# Altium schematic sheet FabricationSumo.SchDoc
size A4; SheetNumber: 1; SheetTotal: 1
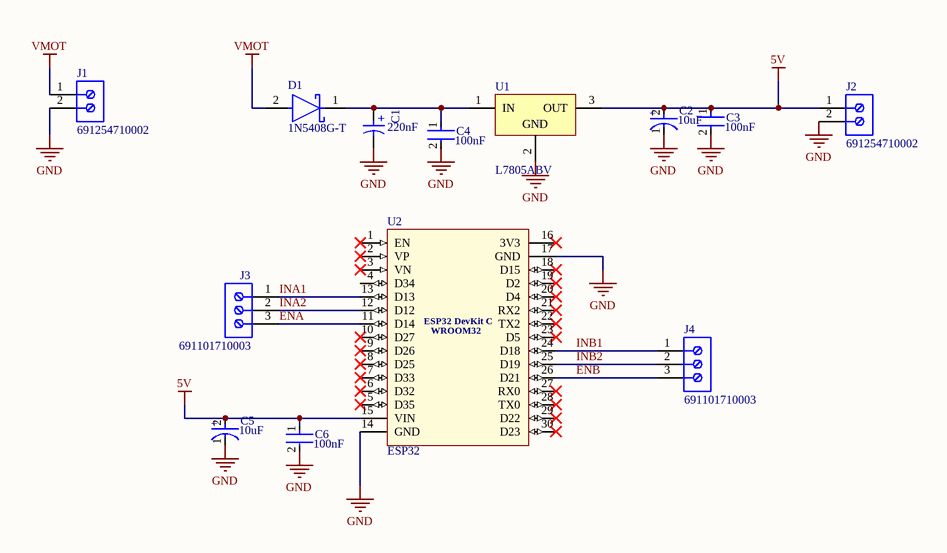
[diagram p0: FabricationSumo.SchDoc]

## Parts
C1  Capacitance: 220nF  [WCAP-ATG5_D5H11]  (hidden comment: 860020672002)
C2  Capacitance: 10uF  [FP-RAD-TH-D_4_0_5-L_7_1-F-MFG]  (hidden comment: EEAGA1E100E)
C3  Capacitance: 100nF  [FP-RDE3M1-MFG]  (hidden comment: RDED72W104K3K1H03B)
C4  Capacitance: 100nF  [FP-RDE3M1-MFG]  (hidden comment: RDED72W104K3K1H03B)
C5  Capacitance: 10uF  [FP-RAD-TH-D_4_0_5-L_7_1-F-MFG]  (hidden comment: EEAGA1E100E)
C6  Capacitance: 100nF  [FP-RDE3M1-MFG]  (hidden comment: RDED72W104K3K1H03B)
D1  1N5408G-T  [FP-DO-201AD-MFG]
J1  691254710002  [691254710002]
J2  691254710002  [691254710002]
J3  691101710003  [691101710003]
J4  691101710003  [691101710003]
U1  L7805ABV  [TO220]
U2  ESP32  [ESP32_DevKitCWROOM32]

## Nets
5V: C2.2(A) C3.1 C5.2(A) C6.1 J2.1 U1.3(OUT) U2.15(VIN)
GND: C1.2(N) C2.1(C) C3.2 C4.2 C5.1(C) C6.2 J1.2 J2.2 U1.2(GND) U2.14(GND) U2.17(GND)
VMOT: D1.2(A) J1.1
ENA: J3.3 U2.11(D14)
ENB: J4.3 U2.26(D21)
INA1: J3.1 U2.13(D13)
INA2: J3.2 U2.12(D12)
INB1: J4.1 U2.24(D18)
INB2: J4.2 U2.25(D19)
NetC1_1: C1.1(P) C4.1 D1.1(C) U1.1(IN)

Not connected (* = marked no-connect by the designer): U2 1(EN)* 2(VP)* 3(VN)* 4(D34) 5(D35)* 6(D32)* 7(D33)* 8(D25)* 9(D26)* 10(D27)* 16(3V3)* 18(D15)* 19(D2)* 20(D4)* 21(RX2)* 22(TX2)* 23(D5)* 27(RX0)* 28(TX0)* 29(D22)* 30(D23)*

## Notes on the sheet
- Documento:
- Autor:
- Carnet:
- Proyecto:
- Curso:
- Fecha:
- Revisión:
- Tamaño:
- Carta
- Hoja:
- de:
- (in symbol CMP-03913-53914225-2) +
- (in symbol CMP-05427-000151-1) +
- (in symbol ESP32-WROOM32) ESP32 DevKit C; WROOM32

## Library data of the parts
C1 = CMP-03913-53914225-2: WCAP-ATG5 Aluminum Electrolytic Capacitors; Voltage Rating (DC): 50V; Life (Hours): 2000hours; Tolerance: 20%; Leakage Current: 3µA; Pitch: 2mm; Polarity: Polar; Ripple Current: 2.9mA; Lead Pitch: 2.0066mm; Diameter: 5mm; RoHS: Compliant; REACH SVHC: Unknown; Mount: Through Hole; Voltage Rating: 50V; Max Operating Temperature: 105°C; Packaging: Tape & Box (TB); Case/Package: Radial; Height - Seated (Max): 12.4968mm; Min Operating Temperature: -40°C; Height: 11mm; Length: 11mm
C2 C5 = CMP-05427-000151-1: Aluminum Electrolytic Capacitors (Radial Lead Type) 10uF ±20% 25V
C3 C4 C6 = CMP-06035-016817-1: Ceramic Capacitor 100nF ±10% 450V X7T Radial; Tolerance: 10%; Voltage Rating: 450V; Lead Pitch: 5mm; Max Operating Temperature: 125°C; Voltage Rating (DC): 450V; Case/Package: Radial; Dielectric: X7T; Min Operating Temperature: -55°C; REACH SVHC: No SVHC
D1 = CMP-12790-000042-1: DIODE SCHOTTKY 40V 1A DO41; Manufacturer: Diodes Inc.; Manufacturer Part Number: 1N5819-T; Description: Diode Schottky 40V 1A Through Hole DO-41; Max Surge Forward Current: 25A; Capacitance: 110 pF; Max Junction Temp: +125°C; Peak Reverse Current: 1mA; Value: 110 pF; Temperature Range Low: -65°C; Footprint Url: https://www.diodes.com/assets/Package-Files/DO-41-Plastic.pdf; Digikey Description: DIODE SCHOTTKY 40V 1A DO41; Category: Diode; Mouser Description: Schottky Diodes & Rectifiers Vr/40V Io/1A T/R; Device Class L2: Diodes; Temperature Range High: +125°C; RoHS: TRUE; Device Class L3: Schottky Diodes; ComponentLink2Description: Datasheet; Temperature: -65°C to +125°C; Reverse Voltage: 40V; Height: 2.72mm; ComponentLink2URL: https://www.diodes.com/assets/Datasheets/ds23001.pdf; Forward Current: 1A; Lead Free: Yes; Device Class L1: Discrete Semiconductors; Max Repetitive Reverse Voltage: 40V; Ipc Land Pattern Name: DIOPA1091W105L521D272; Automotive: No; Package: DO-41 (Plastic); Octopart: https://octopart.com/1n5819-t-diodes+inc.-55389586
J1 J2 = CMP-1502-02591-3: Terminal Block, 5MM Pitch, Horizontal, Rising Cage Clamp, 16-30 AWG, 2 Pin
J3 J4 = CMP-1502-03257-3: 101 Series 5MM Pitch Straight, Pcb Terminal Block, Through Hole, 3 Way; Current Rating: 16A; Voltage Rating: 250V; Stripping Length: -7mm; Wire Gauge (Min): 14AWG; Pitch: 5.0038mm; Number of Positions Per Level: 3; Plating: Steel; Wire/Cable Gauge: 26AWG; Number of Levels: 1; Height: 16.4mm; Min Operating Temperature: -40°C; Width: 16.2mm; Termination: Screw; Number of Pins: 3; Color: Blue; Max Operating Temperature: 105°C; Lead Pitch: 5mm; Voltage: 250V; Packaging: Box; Current: 16A; RoHS: Compliant; Contact Plating: Tin; Housing Material: Nylon; Number of Contacts: 3; Mount: Through Hole; Wire Gauge (Max): 26AWG; Length: 9mm; Contact Material: Brass
U1 = CMP-0244-00485-1: Positive Voltage Regulator, 5V, 3-Pin TO-220; ComponentLink1URL: http://www.st.com; PackageDescription: TO, Thru-Hole, Vertical, Heatsink Mounted; 3 In-Line Leads; Pitch 2.54 mm; DatasheetVersion: 16/11/2011; ComponentLink2Description: Datasheet; ComponentLink1Description: Manufacturer URL; PackageReference: TO220; ComponentLink3Description: Package Specification; ComponentLink2URL: http://www.st.com/internet/com/TECHNICAL_RESOURCES/TECHNICAL_LITERATURE/DATASHEET/CD00000444.pdf; ComponentLink3URL: http://www.st.com/internet/com/TECHNICAL_RESOURCES/TECHNICAL_LITERATURE/PACKAGE_INFORMATION/CD00004649.pdf; PackageVersion: ver3.0
U2 = ESP32-WROOM32: Multiprotocol Modules SMD Module ESP32-WROOM-32E, ESP32-D0WD-V3, 16 MB SPI flash, PCB antenna; Manufacturer: Espressif Systems; Manufacturer Part Number: ESP32-WROOM-32E-N16; Max Supply Voltage: 3.6V; Min Supply Voltage: 3V; Operating Supply Voltage: 3.3V; Supplier: DigiKey; Supplier Part Number: 5407-ESP32-WROOM-32E-N16CT-ND; RoHS: Compliant; Category: RF Transceiver Modules and Modems; Stock: 9659; Pricing: 1=5.71, 10=4.941, 25=4.6748, 100=4.3087, 250=4.0894 (USD); Height - Seated (Max): 3.25mm; Harmonized Tariff Schedule (HTS) Code: 8542.31.00.30; Length: 25.5mm; Max Operating Temperature: 85°C; Min Operating Temperature: -40°C; Number of Terminals: 38; REACH SVHC: Yes; Terminal Pitch: 1.27mm; Width: 18mm; ComponentLink1URL: https://datasheet.octopart.com:443/ESP32-WROOM-32E-N16-Espressif-Systems-datasheet-182247776.pdf?src-supplier=IHS; ComponentLink1Description: https://datasheet.octopart.com:443/ESP32-WROOM-32E-N16-Espressif-Systems-datasheet-182247776.pdf?src-supplier=IHS; ComponentLink2URL: https://datasheet.octopart.com:443/ESP32-WROOM-32E-N16-Espressif-Systems-datasheet-192340067.pdf?src-supplier=HQonline; ComponentLink2Description: https://datasheet.octopart.com:443/ESP32-WROOM-32E-N16-Espressif-Systems-datasheet-192340067.pdf?src-supplier=HQonline; ComponentLink3URL: https://datasheet.octopart.com:443/ESP32-WROOM-32E-N16-Espressif-Systems-datasheet-188867343.pdf?src-supplier=TME; ComponentLink3Description: https://datasheet.octopart.com:443/ESP32-WROOM-32E-N16-Espressif-Systems-datasheet-188867343.pdf?src-supplier=TME; ComponentLink4URL: https://datasheet.octopart.com:443/ESP32-WROOM-32E-N16-Espressif-Systems-datasheet-165560559.pdf?src-supplier=TME; ComponentLink4Description: https://datasheet.octopart.com:443/ESP32-WROOM-32E-N16-Espressif-Systems-datasheet-165560559.pdf?src-supplier=TME; ComponentLink5URL: https://datasheet.octopart.com:443/ESP32-WROOM-32E-N16-Espressif-Systems-datasheet-151884363.pdf?src-supplier=Future+Electronics; ComponentLink5Description: https://datasheet.octopart.com:443/ESP32-WROOM-32E-N16-Espressif-Systems-datasheet-151884363.pdf?src-supplier=Future+Electronics